# EAGLE design THW_Schematic_v1.0.0 (EAGLE 9.1.3)
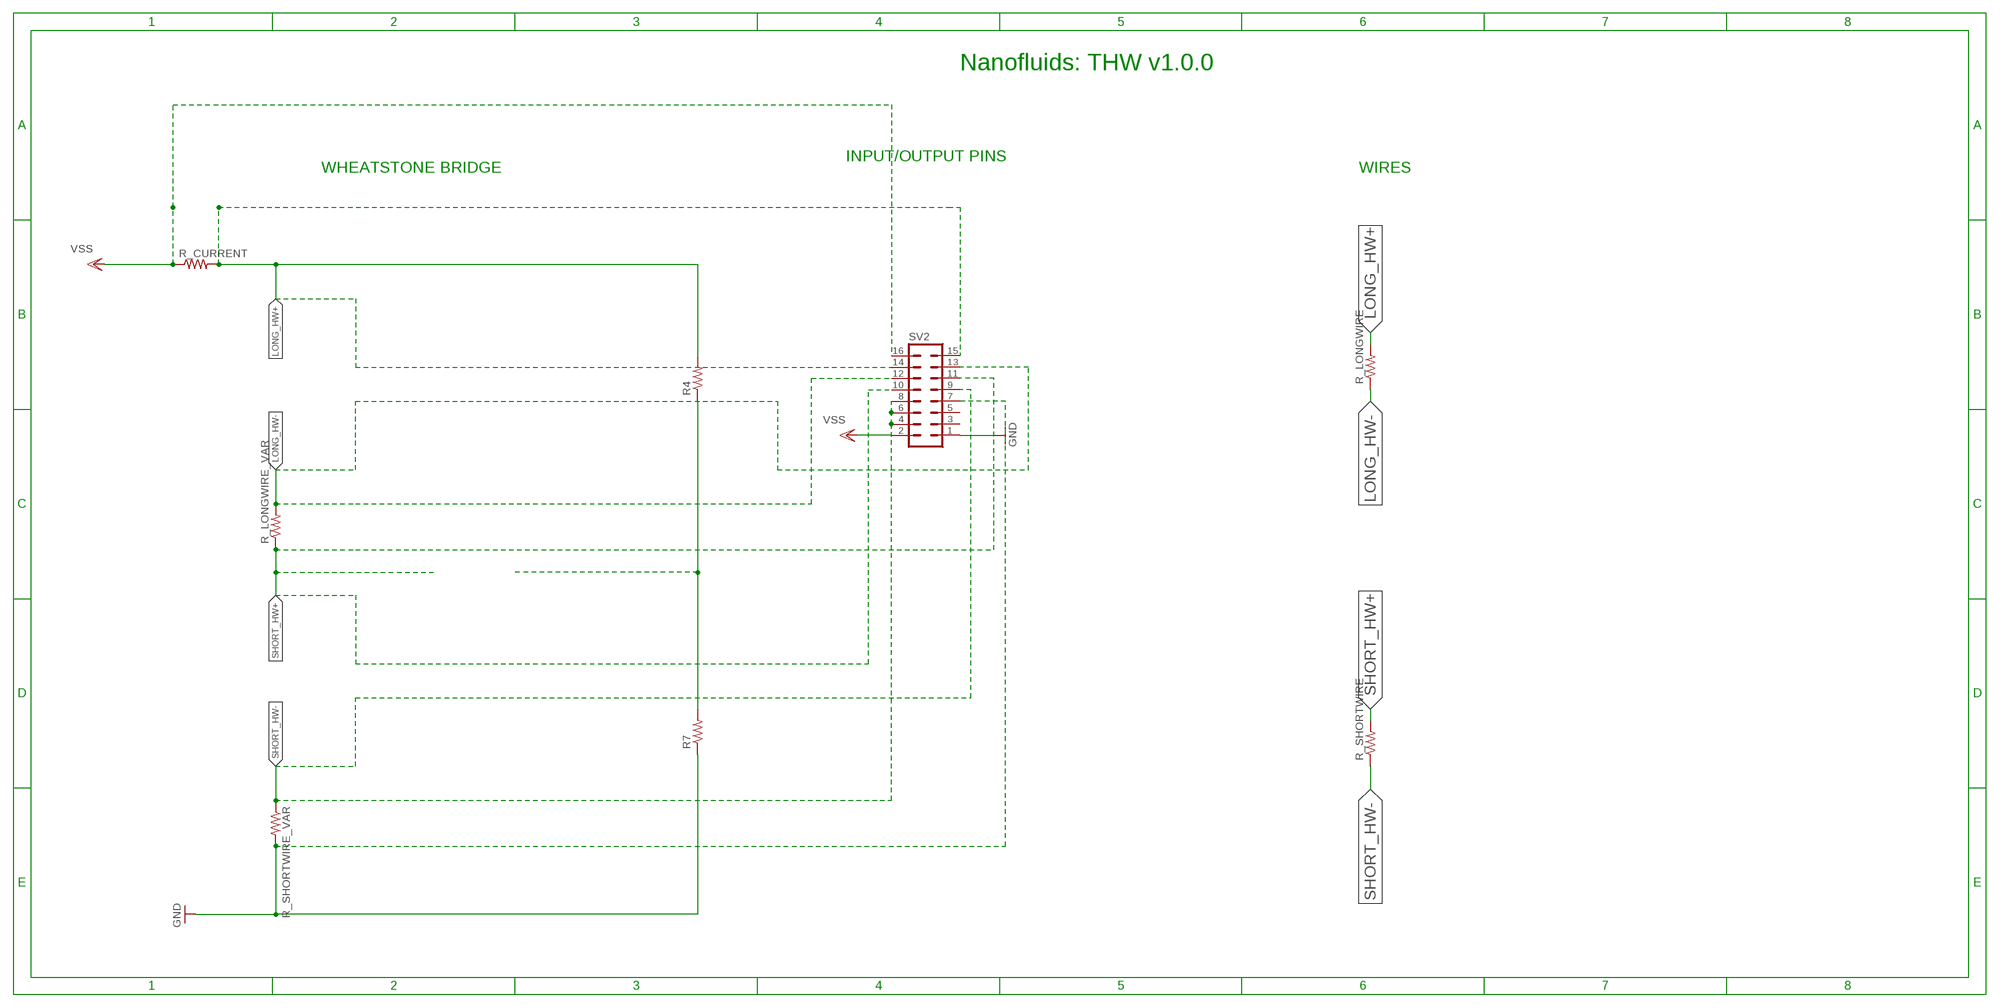
[diagram p0: schematic, sheet 1]

## Parts
R4  R-US_M0805  [M0805]
R7  R-US_M0805  [M0805]
R_CURRENT  R-US_M0805  [M0805]
R_LONGWIRE  R-US_M0805  [M0805]
R_LONGWIRE_VAR  R-US_M0805  [M0805]
R_SHORTWIRE  R-US_M0805  [M0805]
R_SHORTWIRE_VAR  R-US_M0805  [M0805]
SV2  MA08-2W  [MA08-2W]

## Nets
GND: R7.1 R_SHORTWIRE_VAR.2 SV2.1 SV2.7
LONG_HW+: R4.2 R_CURRENT.2 R_LONGWIRE.2 SV2.14 SV2.15
LONG_HW-: R_LONGWIRE.1 R_LONGWIRE_VAR.2 SV2.12 SV2.13
N$2: R4.1 R7.2
SENS_1+: R_CURRENT.1 SV2.16 ; supply symbol labelled VSS
SHORT_HW+: R_LONGWIRE_VAR.1 R_SHORTWIRE.2 SV2.10 SV2.11
SHORT_HW-: R_SHORTWIRE.1 R_SHORTWIRE_VAR.1 SV2.4 SV2.6 SV2.8 SV2.9
VSS: SV2.2
Unconnected: SV2.3 SV2.5

## Notes on the sheet
- Nanofluids: THW v1.0.0
- INPUT/OUTPUT PINS
- WHEATSTONE BRIDGE | WIRES

## Library data of the parts
R4 R7 R_CURRENT R_LONGWIRE R_LONGWIRE_VAR R_SHORTWIRE R_SHORTWIRE_VAR = resistor:R-US_: RESISTOR, American symbol
SV2 = con-lstb:MA08-2W: PIN HEADER; OC_FARNELL: unknown; OC_NEWARK: unknown

## Board
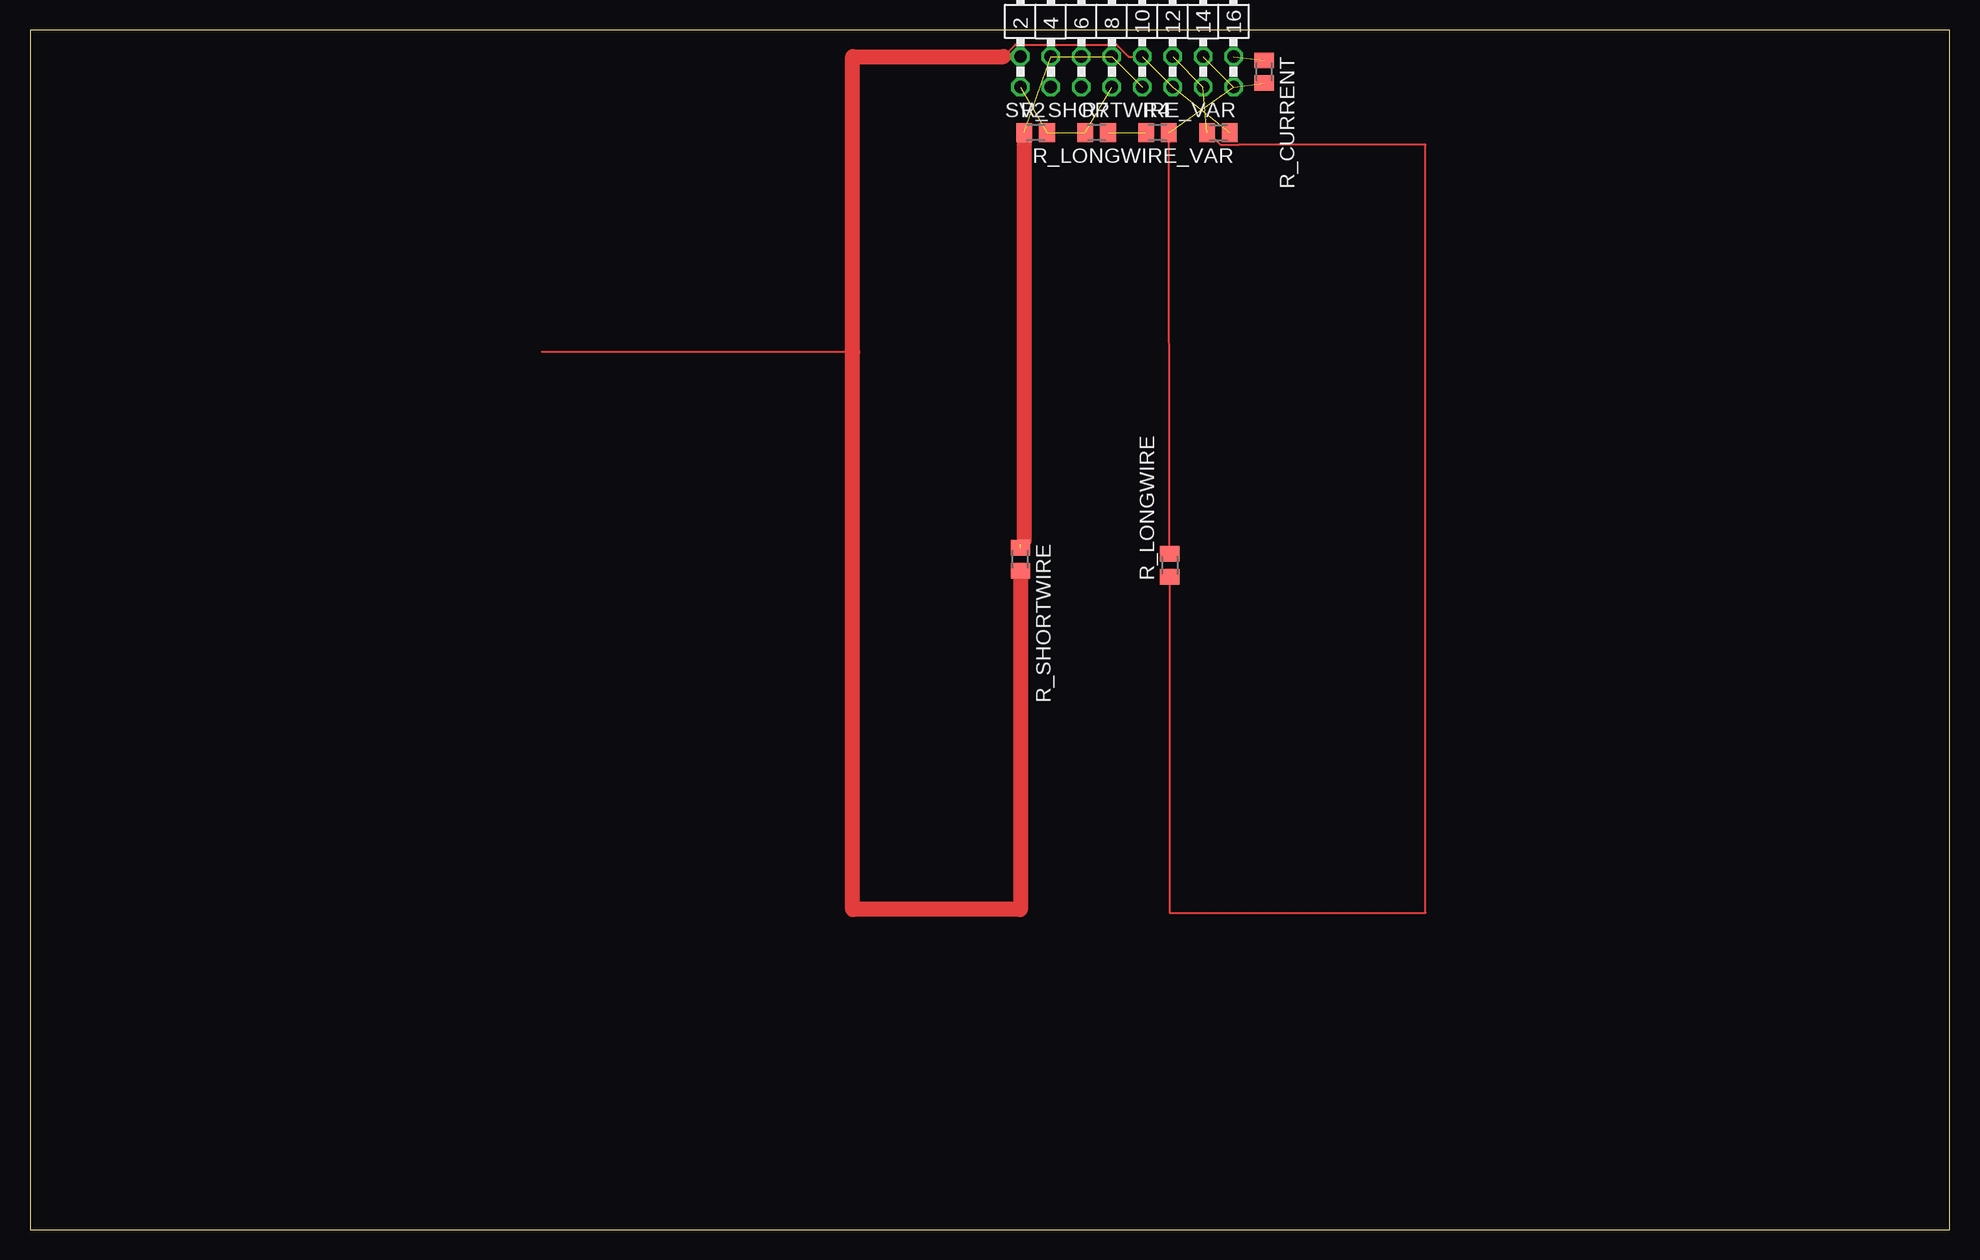
[diagram p1: board, top side]

Size 160 x 100 mm. Coordinates in mm from the lower left corner, seen from the top.
Outline: 0,0 160,0 160,100 0,100 0,0
Copper layers (1*16): Top 0.035mm / dielectric 1.5mm / Bottom 0.035mm
Design rules "default": minimum track width 6mil, minimum drill 0.35mm, track to track 6mil, track to pad 6mil, pad to pad 6mil, via to via 6mil, smd to smd 6mil, copper to edge 40mil, drill to drill 6mil, minimum pad ring 10mil, minimum via ring 8mil, stop-mask expansion 4mil, vias tented up to drill 0mil, thermal gap 10mil

### Footprints (pad centres in the part's own frame; a part is rotated, then mirrored left to right if it is on the bottom)
M0805 = smd 1.3 x 1.6: 1 -0.95,0; 2 0.95,0
MA08-2W = drill 1.016 octagon: 1 -8.89,-1.27; 2 -8.89,1.27; 3 -6.35,-1.27; 4 -6.35,1.27; 5 -3.81,-1.27; 6 -3.81,1.27; 7 -1.27,-1.27; 8 -1.27,1.27; 9 1.27,-1.27; 10 1.27,1.27; 11 3.81,-1.27; 12 3.81,1.27; 13 6.35,-1.27; 14 6.35,1.27; 15 8.89,-1.27; 16 8.89,1.27

### Placement (x,y rotation side)
R4  93.98,91.44 0 top
R7  88.9,91.44 0 top
R_CURRENT  102.87,96.52 270 top
R_LONGWIRE  95,55.37 90 top
R_LONGWIRE_VAR  99.06,91.44 180 top
R_SHORTWIRE  82.55,55.88 270 top
R_SHORTWIRE_VAR  83.82,91.44 0 top
SV2  91.44,96.52 0 top

### Tracks (layer width: path | path; a pad name or v marks a point on that pad's centre or on a via)
GND  (3 unrouted)
LONG_HW+  (3 unrouted)
  Top 0.152: R_LONGWIRE.2 R4.2
LONG_HW-  (2 unrouted)
  Top 0.152: R_LONGWIRE.1 95,26.42 116.33,26.42 116.33,90.42 100.77,90.42 100.75,90.41 99.27,90.41 98.24,91.44 R_LONGWIRE_VAR.2
N$2  (1 unrouted)
SENS_1+  (1 unrouted)
SHORT_HW+  (2 unrouted)
  Top 0.152: SV2.10 91.57,97.79 90.58,98.78 82.14,98.78 81.15,97.79 | 68.58,73.15 42.67,73.15
  Top 1.27: R_SHORTWIRE.2 82.55,26.67 68.58,26.67 68.58,73.15 68.58,97.79 81.15,97.79
SHORT_HW-  (5 unrouted)
  Top 0.152: 82.87,57.47 82.55,57.15
  Top 1.27: R_SHORTWIRE_VAR.1 82.87,57.47